# Altium schematic sheet Arduboy_V2.SchDoc
size A3
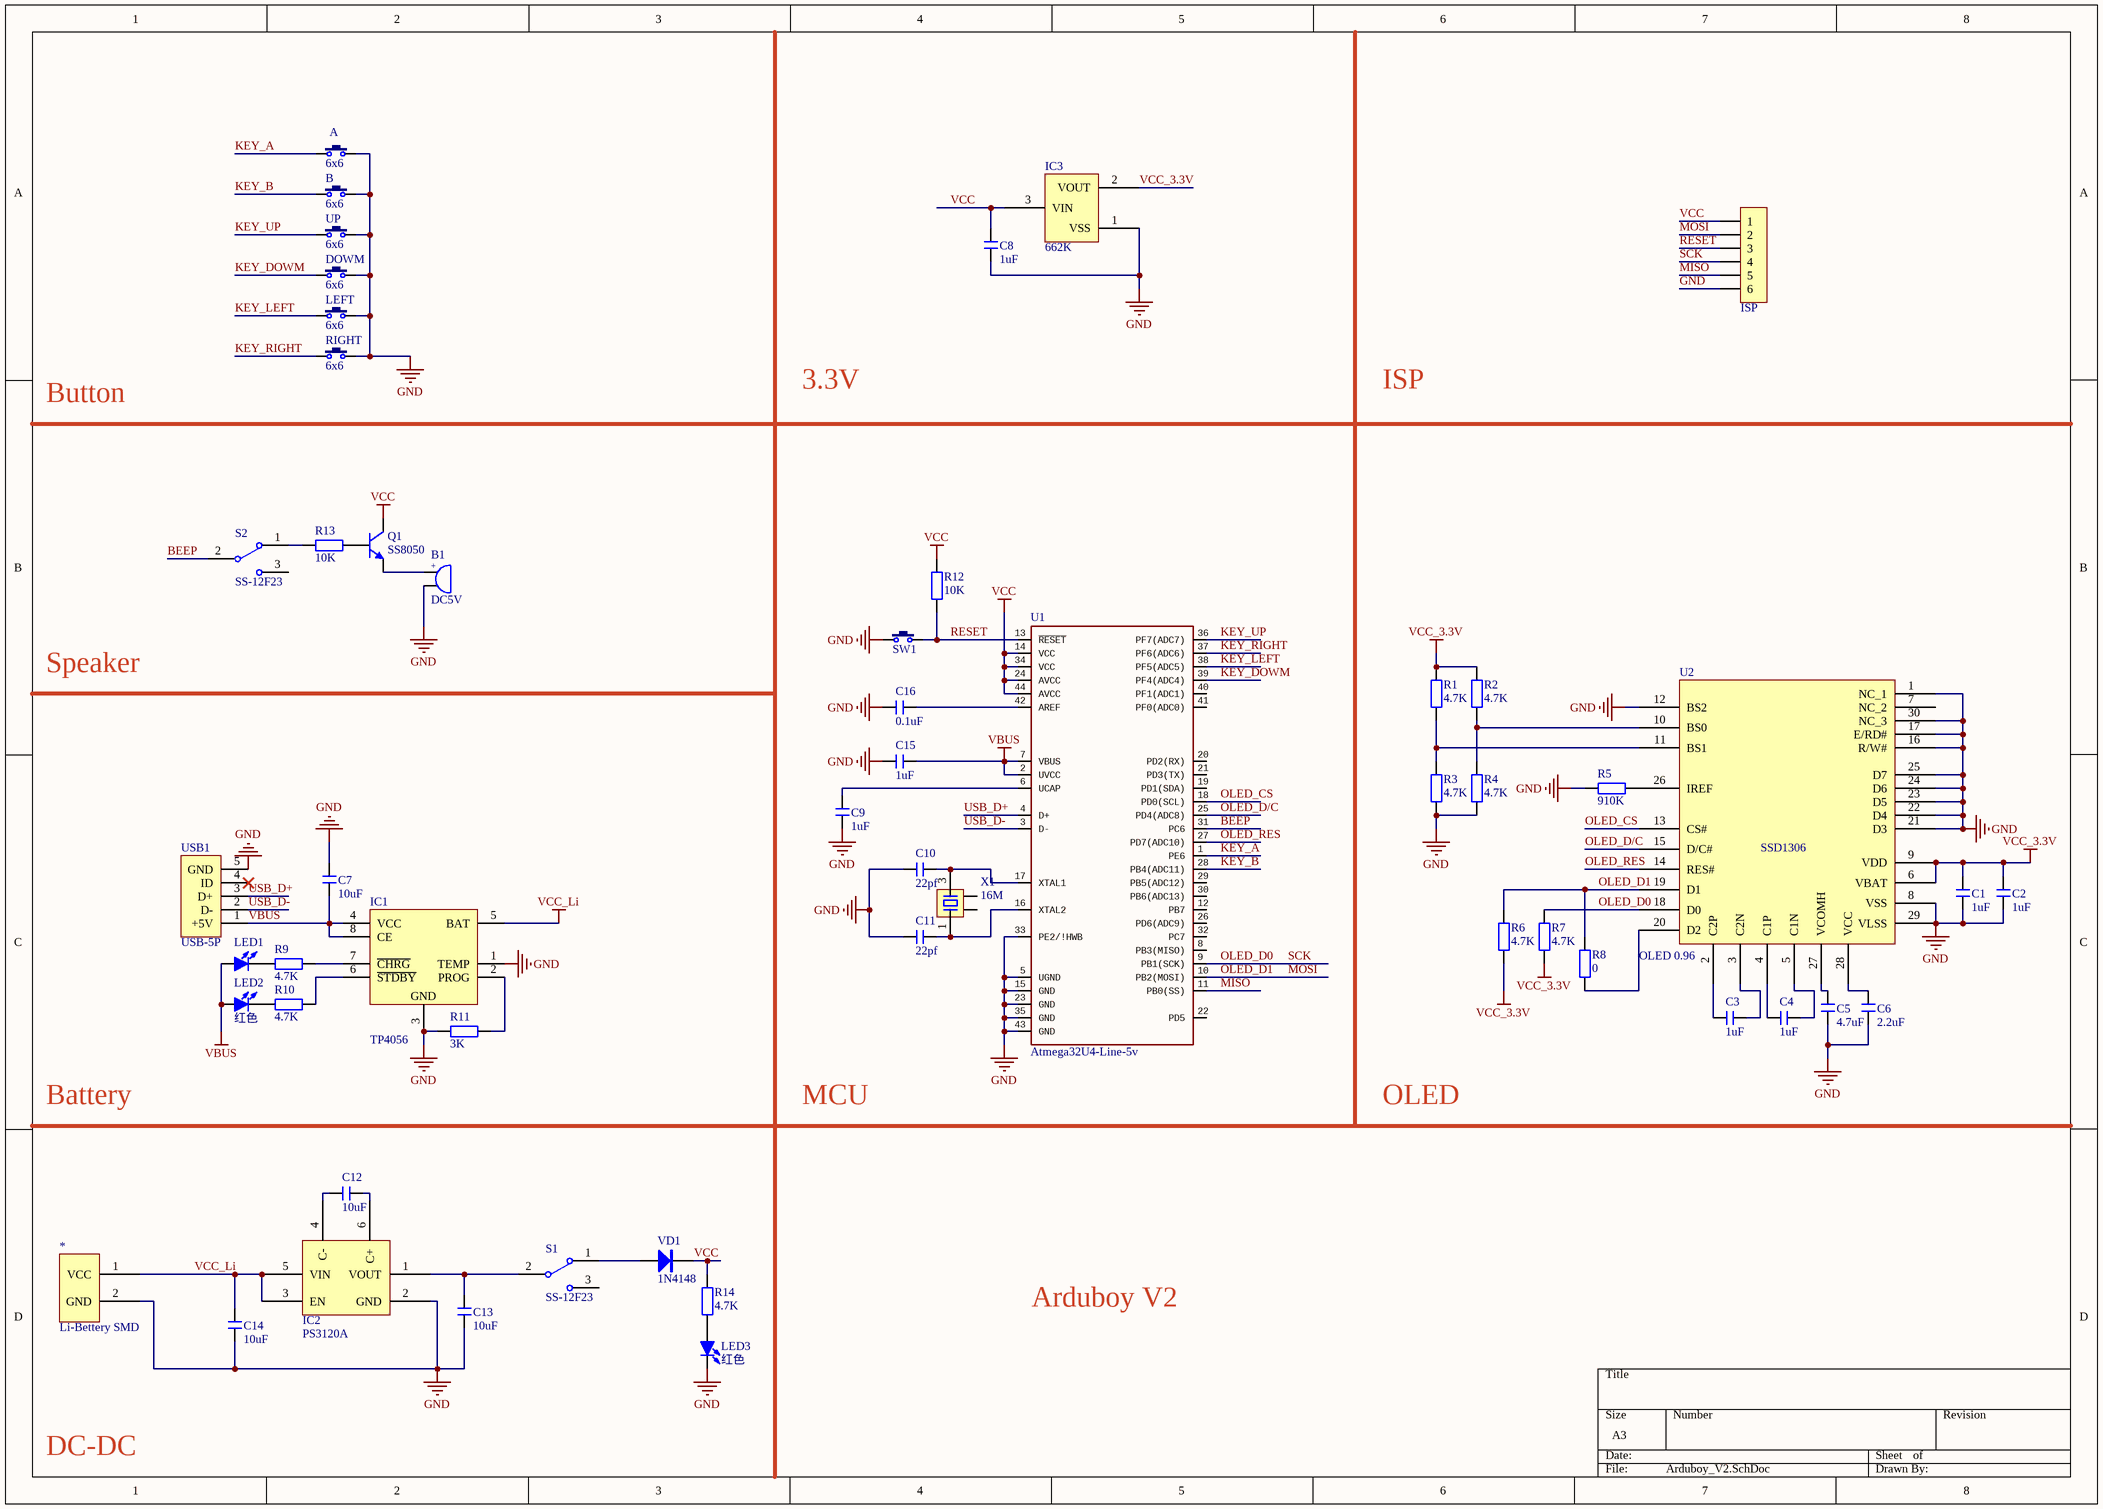
[diagram p0: Arduboy_V2.SchDoc]

## Parts
*  Li-Bettery SMD  [Li-Bettery SMD]
A  6x6  [SW SMD-2]
B  6x6  [SW SMD-2]
B1  DC5V  [BEEP-SMD 5x5x2]
C1  1uF  [C 0805]
C2  1uF  [C 0805]
C3  1uF  [C 0805]
C4  1uF  [C 0805]
C5  4.7uF  [C 0805]
C6  2.2uF  [C 0805]
C7  10uF  [C 0805]
C8  1uF  [C 0805]
C9  1uF  [C 0805]
C10  22pf  [C 0805]
C11  22pf  [C 0805]
C12  10uF  [C 0805]
C13  10uF  [C 0805]
C14  10uF  [C 0805]
C15  1uF  [C 0805]
C16  0.1uF  [C 0805]
DOWM  6x6  [SW SMD-2]
IC1  TP4056  [SOP8_N]
IC2  PS3120A  [SOT23-6M]
IC3  662K  [SOT23-3M]
ISP  HDR-1X6  [HDR-1X6]  (value not drawn)
LED1  (no value)  [LED 0805B]
LED2  红色  [LED 0805R]
LED3  红色  [LED 0805B]
LEFT  6x6  [SW SMD-2]
Q1  SS8050  [SOT23-3M]
R1  4.7K  [R 0805]
R2  4.7K  [R 0805]
R3  4.7K  [R 0805]
R4  4.7K  [R 0805]
R5  910K  [R 0805]
R6  4.7K  [R 0805]
R7  4.7K  [R 0805]
R8  0  [R 0805]
R9  4.7K  [R 0805]
R10  4.7K  [R 0805]
R11  3K  [R 0805]
R12  10K  [R 0805]
R13  10K  [R 0805]
R14  4.7K  [R 0805]
RIGHT  6x6  [SW SMD-2]
S1  SS-12F23  [MSK-12C01-07]
S2  SS-12F23  [MSK-12C01-07]
SW1  3x6x5  [TSW SMD-3*6*4.3]  (value not drawn)
U1  Atmega32U4-Line-5v  [TQFP44 10x10_M]
U2  OLED 0.96  [OLED 0.96]
UP  6x6  [SW SMD-2]
USB1  USB-5P  [USB-MICRO_B]
VD1  1N4148  [SOD-323]
X1  16M  [XTAL-5032]

## Nets
GND: *.2(GND) A.2 B.2 B1.2 C1.1 C2.1 C5.1 C6.1 C7.2 C8.2 C9.2 C10.1 C11.1 C13.1 C14.1 C15.1 C16.1 DOWM.2 IC1.1(TEMP) IC1.3(GND) IC2.2(GND) IC3.1(VSS) ISP.6 LED3.2(K) LEFT.2 R3.1 R4.1 R5.1 R11.1 RIGHT.2 SW1.1 U1.5(UGND) U1.15(GND) U1.23(GND) U1.33(PE2/!HWB) U1.35(GND) U1.43(GND) U2.1(NC_1) U2.8(VSS) U2.12(BS2) U2.16(R/W#) U2.17(E/RD#) U2.21(D3) U2.22(D4) U2.23(D5) U2.24(D6) U2.25(D7) U2.29(VLSS) U2.30(NC_3) UP.2 USB1.5(GND)
VBUS: C7.1 C15.2 IC1.4(VCC) IC1.8(CE) LED1.1(A) LED2.1(A) U1.2(UVCC) U1.7(VBUS) USB1.1(+5V)
VCC: C8.1 IC3.3(VIN) ISP.1 Q1.3(C) R12.2 R14.2 U1.14(VCC) U1.24(AVCC) U1.34(VCC) U1.44(AVCC) VD1.2(K)
VCC_3.3V: C1.2 C2.2 IC3.2(VOUT) R1.2 R2.2 R6.1 R7.1 U2.6(VBAT) U2.9(VDD)
VCC_Li: *.1(VCC) C14.2 IC1.5(BAT) IC2.3(EN) IC2.5(VIN)
BEEP: S2.2 U1.31(PC6)
KEY_A: A.1 U1.1(PE6)
KEY_B: B.1 U1.28(PB4(ADC11))
KEY_DOWM: DOWM.1 U1.39(PF4(ADC4))
KEY_LEFT: LEFT.1 U1.38(PF5(ADC5))
KEY_RIGHT: RIGHT.1 U1.37(PF6(ADC6))
KEY_UP: U1.36(PF7(ADC7)) UP.1
MISO: ISP.5 U1.11(PB0(SS))
MOSI: ISP.2 R6.2 R8.2 U1.10(PB2(MOSI)) U2.19(D1)  [also labelled OLED_D1]
OLED_CS: U1.18(PD0(SCL)) U2.13(CS#)
OLED_D0: ISP.4 R7.2 U1.9(PB1(SCK)) U2.18(D0)  [also labelled SCK]
OLED_D/C: U1.25(PD4(ADC8)) U2.15(D/C#)
OLED_RES: U1.27(PD7(ADC10)) U2.14(RES#)
RESET: ISP.3 R12.1 SW1.2 U1.13(~{RESET})
USB_D+: U1.4(D+) USB1.3(D+)
USB_D-: U1.3(D-) USB1.2(D-)
NetB1_1: B1.1 Q1.2(E)
NetC3_1: C3.1 U2.2(C2P)
NetC3_2: C3.2 U2.3(C2N)
NetC4_1: C4.1 U2.4(C1P)
NetC4_2: C4.2 U2.5(C1N)
NetC5_2: C5.2 U2.27(VCOMH)
NetC6_2: C6.2 U2.28(VCC)
NetC9_1: C9.1 U1.6(UCAP)
NetC10_2: C10.2 U1.17(XTAL1) X1.3
NetC11_2: C11.2 U1.16(XTAL2) X1.1
NetC12_1: C12.1 IC2.4(C-)
NetC12_2: C12.2 IC2.6(C+)
NetC13_2: C13.2 IC2.1(VOUT) S1.2
NetC16_2: C16.2 U1.42(AREF)
NetIC1_2: IC1.2(PROG) R11.2
NetIC1_6: IC1.6(~{STDBY}) R10.2
NetIC1_7: IC1.7(~{CHRG}) R9.2
NetLED1_2: LED1.2(K) R9.1
NetLED2_2: LED2.2(K) R10.1
NetLED3_1: LED3.1(A) R14.1
NetQ1_1: Q1.1(B) R13.2
NetR1_1: R1.1 R3.2 U2.11(BS1)
NetR2_1: R2.1 R4.2 U2.10(BS0)
NetR5_2: R5.2 U2.26(IREF)
NetR8_1: R8.1 U2.20(D2)
NetR13_1: R13.1 S2.1
NetS1_1: S1.1 VD1.1(A)

Not connected (* = marked no-connect by the designer): S1 3; S2 3; U1 8(PB3(MISO)) 12(PB7) 19(PD1(SDA)) 20(PD2(RX)) 21(PD3(TX)) 22(PD5) 26(PD6(ADC9)) 29(PB5(ADC12)) 30(PB6(ADC13)) 32(PC7) 40(PF1(ADC1)) 41(PF0(ADC0)); U2 7(NC_2); USB1 4(ID)*; X1 2 4

## Notes on the sheet
- Button
- 3.3V
- ISP
- Speaker
- Battery
- MCU
- OLED
- Arduboy V2
- DC-DC
- (in symbol BEEP) +
- (in symbol OLED 0.96) SSD1306

## Library data of the parts
A B DOWM LEFT RIGHT UP = SW SMD-2: Arduboy 用
B1 = BEEP: 蜂鸣器; 版权归属: 黎明电子style; BOM名称: 蜂鸣器; 学习资源: https://lmdzstyle.taobao.com/
C1-C16 = C: 无极性贴片电容; 版权归属: 黎明电子style; BOM名称: 无极性贴片电容; 学习资源: https://lmdzstyle.taobao.com/
IC1 = TP4056: 锂电池充电管理; 版权归属: 黎明电子style; BOM名称: 锂电池充电管理; 学习资源: https://lmdzstyle.taobao.com/
IC2 = PS3120A: 5V升压芯片
IC3 = 662K: 3.3V LEO稳压IC
ISP = Header 6: 6P接插件; 版权归属: 黎明电子style; BOM名称: 6P接插件; 学习资源: https://lmdzstyle.taobao.com/
LED1-LED3 = LED-SMD: 贴片LED; 版权归属: 黎明电子style; BOM名称: 贴片LED; 学习资源: https://lmdzstyle.taobao.com/
Q1 = 8050-SMD: 高频放大-NPN型; 版权归属: 黎明电子style; 属性: 40V 1.5A 1W 100MHZ; BOM名称: 高频放大-NPN型; 学习资源: https://lmdzstyle.taobao.com/
R1-R14 = R: 贴片电阻; 版权归属: 黎明电子style; BOM名称: 贴片电阻; 学习资源: https://lmdzstyle.taobao.com/
S1 S2 = SSW-1P: 1路波动开关; BOM名称: 波动开关; 版权归属: 黎明电子style; 学习资源: https://lmdzstyle.taobao.com/
SW1 = TSW 3x6: 3x6轻触开关; 版权归属: 黎明电子style; BOM名称: 3x6轻触开关; 学习资源: https://lmdzstyle.taobao.com/
USB1 = USB-5P: 微型USB母座; 版权归属: 黎明电子style; BOM名称: 微型USB母座; 学习资源: https://lmdzstyle.taobao.com/
VD1 = 1N4148: 高速开关二极管; 版权归属: 黎明电子style; BOM名称: 高速开关二极管; 学习资源: https://lmdzstyle.taobao.com/
X1 = XTAL-4: 4脚晶振; 版权归属: 黎明电子style; BOM名称: 4脚晶振; 学习资源: https://lmdzstyle.taobao.com/